# Altium schematic sheet M.2_Key_A+E.SchDoc
size 420 x 297 mm; CompanyName: Septentrio; Organization: Designed by ANavS; Address1: Septentrio; Address2: Interleuvenlaan 15i; Address3: 3001, Leuven; Address4: Belgium; SheetNumber: 2; SheetTotal: 3
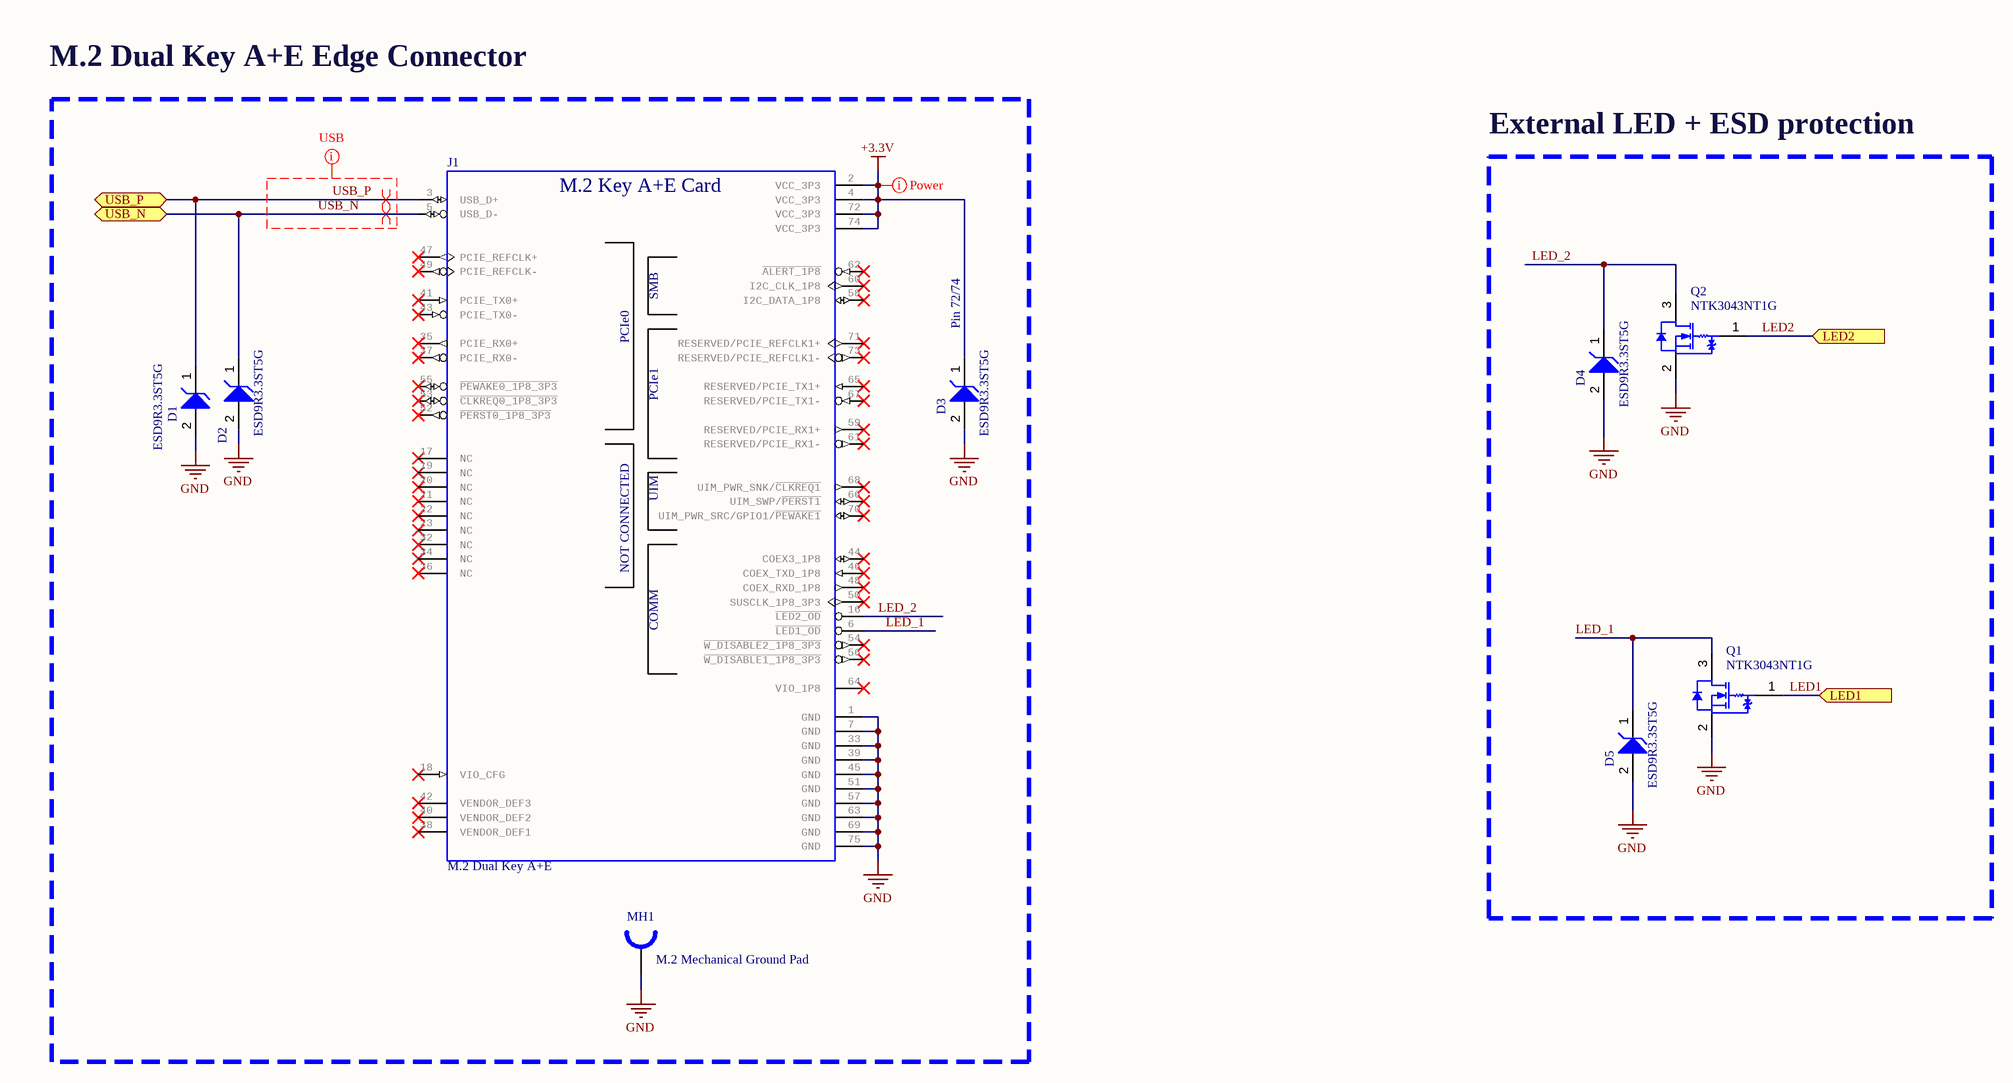
[diagram p0: M.2_Key_A+E.SchDoc]

## Parts
D1  ESD9R3.3ST5G  [ONSC-SOD-923-2-514AB-01_V]
D2  ESD9R3.3ST5G  [ONSC-SOD-923-2-514AB-01_V]
D3  ESD9R3.3ST5G  [ONSC-SOD-923-2-514AB-01_V]
D4  ESD9R3.3ST5G  [ONSC-SOD-923-2-514AB-01_V]
D5  ESD9R3.3ST5G  [ONSC-SOD-923-2-514AB-01_V]
J1  M.2 Dual Key A+E  [M.2 Key A+E card-Footprint]  (no BOM)
MH1  M.2 Mechanical Ground Pad  [M.2 Mechanical Ground Pad Footprint]  (no BOM)
Q1  NTK3043NT1G  [ONSC-SOT-723-3-631AA-01_V]
Q2  NTK3043NT1G  [ONSC-SOT-723-3-631AA-01_V]

## Blocks framed on the sheet
Pin 72/74: D1-D3 J1 MH1
External LED + ESD protection: D4 D5 Q1 Q2

## Ports
LED1 (in), LED2 (in), USB_N (bidir), USB_P (bidir)

## Nets
+3.3V: D3.1(K) J1.2(VCC_3P3) J1.4(VCC_3P3) J1.72(VCC_3P3) J1.74(VCC_3P3)
GND: D1.2(A) D2.2(A) D3.2(A) D4.2(A) D5.2(A) J1.1(GND) J1.7(GND) J1.33(GND) J1.39(GND) J1.45(GND) J1.51(GND) J1.57(GND) J1.63(GND) J1.69(GND) J1.75(GND) MH1.0(Chassis) Q1.2(S) Q2.2(S)
LED1: Q1.1(G) ; port LED1
LED2: Q2.1(G) ; port LED2
LED_1: D5.1(K) J1.6(~{LED1_OD}) Q1.3(D)
LED_2: D4.1(K) J1.16(~{LED2_OD}) Q2.3(D)
USB_N: D2.1(K) J1.5(USB_D-) ; port USB_N
USB_P: D1.1(K) J1.3(USB_D+) ; port USB_P

Not connected (* = marked no-connect by the designer): J1 17(NC)* 18(VIO_CFG)* 19(NC)* 20(NC)* 21(NC)* 22(NC)* 23(NC)* 32(NC)* 34(NC)* 35(PCIE_RX0+)* 36(NC)* 37(PCIE_RX0-)* 38(VENDOR_DEF1)* 40(VENDOR_DEF2)* 41(PCIE_TX0+)* 42(VENDOR_DEF3)* 43(PCIE_TX0-)* 44(COEX3_1P8)* 46(COEX_TXD_1P8)* 47(PCIE_REFCLK+)* 48(COEX_RXD_1P8)* 49(PCIE_REFCLK-)* 50(SUSCLK_1P8_3P3)* 52(~{PERST0_1P8_3P3})* 53(~{CLKREQ0_1P8_3P3})* 54(~{W_DISABLE2_1P8_3P3})* 55(~{PEWAKE0_1P8_3P3})* 56(~{W_DISABLE1_1P8_3P3})* 58(I2C_DATA_1P8)* 59(RESERVED/PCIE_RX1+)* 60(I2C_CLK_1P8)* 61(RESERVED/PCIE_RX1-)* 62(~{ALERT_1P8})* 64(VIO_1P8)* 65(RESERVED/PCIE_TX1+)* 66(UIM_SWP/~{PERST1})* 67(RESERVED/PCIE_TX1-)* 68(UIM_PWR_SNK/~{CLKREQ1})* 70(UIM_PWR_SRC/GPIO1/~{PEWAKE1})* 71(RESERVED/PCIE_REFCLK1+)* 73(RESERVED/PCIE_REFCLK1-)*

## Layout directives
net class Power: +3.3V
differential pair: USB_N, USB_P
net class USB2.0: USB_N, USB_P

## Notes on the sheet
- M.2 Dual Key A+E Edge Connector
- THIS SOURCE DESCRIBES OPEN HARDWARE AND
- IS LICENSED AS STATED ON THE COVER
- ENG:
- APPROVALS
- DATE
- PROJECT
- DSN:
- CHK:
- VARIANT
- TITLE
- SCALE
- A3
- SIZE
- FILE NAME
- EXPORT DATE
- SHEET
- FAB-REV
- ASM-REV
- OF
- (in symbol CMP-002-00134-7) M.2 Key A+E Card; SMB; PCIe0; PCIe1; UIM; NOT CONNECTED; COMM

## Library data of the parts
D1-D5 = CMP-004-00061-1: ESD9R3.3S Series 4.8 V 0.5 pF Uni-Directional ESD Protection Diode - SOD-923; Breakdown Voltage: 4.8V; Clamping Voltage-Max: 7.8V; Number of Unidirectional Channels: 1; Polarity: Unidirectional; Operating Supply Voltage: 3.3V; Value: 0.9pF; Peak Pulse Current: 1A; ESD Protection: Yes; Max Reverse Leakage Current: 1nA; Max Power Dissipation: 150mW; Power Line Protection: No; Test Current: 1mA; Diode Type: ZENER; Pins: 2; Reach SVHC Compliant: No; Min Operating Temperature: -55°C; Depth: 0.6mm; Height: 0.4mm; Lead Free: Lead Free; Radiation Hardening: No; Number of Elements: 1; Case/Package: SOD-923-2; Number of Channels: 1; Min Breakdown Voltage: 4.8V; Halogen Free: Halogen Free; Width: 0.65mm; Reverse Standoff Voltage: 3.3V; Packaging: Tape and Reel; Package Quantity: 8000; Working Voltage: 3.3V; Max Breakdown Voltage: 4.8V; Length: 0.8mm; Direction: Unidirectional; Max Surge Current: 1A; Termination: SMD/SMT; Max Operating Temperature: 125°C; Leakage Current: 1nA; Peak Pulse Power: 150mW; Clamping Voltage: 7.8V; Series: -; Number of Lines: 1
J1 = CMP-002-00134-7: Golden finger, M.2 Key A+E, Dual, Staggered, Pitch 0.5mm; PCI Express M.2 Specification: Revision 4.0, Version 1.0; ClassName: Edge Connector
MH1 = CMP-00028-00011-5
Q1 Q2 = CMP-013-00043-1: Single N-Channel Small Signal MOSFET with ESD Protection 20V, 285mA, 3.4Ω; Fall Time: 15ns; Max Power Dissipation: 310mW; Drain-source On Resistance-Max: 3.4R; Continuous Drain Current (ID): 210mA; Power Dissipation: 440mW; Turn-Off Delay Time: 94ns; Turn-On Delay Time: 13ns; Threshold Voltage: 400mV; Number of Elements: 1; Input Capacitance: 11pF; Current Rating: 225mA; Gate to Source Voltage (Vgs): 10V; Voltage Rating (DC): 20V; Package Quantity: 4000; Case/Package: SOT-723-3; Rise Time: 15ns; RoHS Compliant: Yes; Height: 0.55mm; Reach SVHC Compliant: No; Drain to Source Breakdown Voltage: 20V; Width: 0.85mm; Packaging: Tape and Reel; Drain to Source Resistance: 3.4R; Pins: 3; Length: 1.25mm; Series: -; Element Configuration: Single; Drain to Source Voltage (Vdss): 20V; Lead Free: Lead Free; Polarity: N-CHANNEL; Radiation Hardening: No; Max Operating Temperature: 150°C; Rds On Max: 3.4R; Min Operating Temperature: -55°C